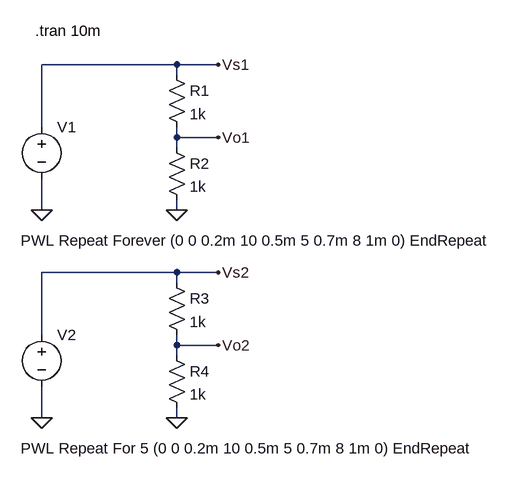
[diagram p0: schematic PwlSource.asc]
PwlSource.asc, the LTspice schematic file:
Version 4
SHEET 1 880 680
WIRE 288 16 80 16
WIRE 352 16 288 16
WIRE 288 32 288 16
WIRE 80 112 80 16
WIRE 288 128 288 112
WIRE 352 128 288 128
WIRE 288 144 288 128
WIRE 80 240 80 192
WIRE 288 240 288 224
WIRE 288 336 80 336
WIRE 352 336 288 336
WIRE 288 352 288 336
WIRE 80 432 80 336
WIRE 288 448 288 432
WIRE 352 448 288 448
WIRE 288 464 288 448
WIRE 80 560 80 512
WIRE 288 560 288 544
FLAG 288 240 0
FLAG 80 240 0
FLAG 352 16 Vs1
FLAG 352 128 Vo1
FLAG 288 560 0
FLAG 80 560 0
FLAG 352 336 Vs2
FLAG 352 448 Vo2
SYMBOL voltage 80 96 R0
WINDOW 3 -32 191 Left 2
WINDOW 123 0 0 Left 0
WINDOW 39 0 0 Left 0
SYMATTR InstName V1
SYMATTR Value PWL Repeat Forever (0 0 0.2m 10 0.5m 5 0.7m 8 1m 0) EndRepeat
SYMBOL res 272 16 R0
SYMATTR InstName R1
SYMATTR Value 1k
SYMBOL res 272 128 R0
SYMATTR InstName R2
SYMATTR Value 1k
SYMBOL voltage 80 416 R0
WINDOW 3 -32 191 Left 2
WINDOW 123 0 0 Left 0
WINDOW 39 0 0 Left 0
SYMATTR InstName V2
SYMATTR Value PWL Repeat For 5 (0 0 0.2m 10 0.5m 5 0.7m 8 1m 0) EndRepeat
SYMBOL res 272 336 R0
SYMATTR InstName R3
SYMATTR Value 1k
SYMBOL res 272 448 R0
SYMATTR InstName R4
SYMATTR Value 1k
TEXT 70 -36 Left 2 !.tran 10m

The netlist it stands for:
* PwlSource.asc
V1 Vs1 0 PWL Repeat Forever (0 0 0.2m 10 0.5m 5 0.7m 8 1m 0) EndRepeat
R1 Vs1 Vo1 1k
R2 Vo1 0 1k
V2 Vs2 0 PWL Repeat For 5 (0 0 0.2m 10 0.5m 5 0.7m 8 1m 0) EndRepeat
R3 Vs2 Vo2 1k
R4 Vo2 0 1k
.tran 10m
.backanno
.end